# Altium schematic sheet thermocouple.SchDoc: Thermocouple Interface
size A4; SheetNumber: 6; SheetTotal: 7
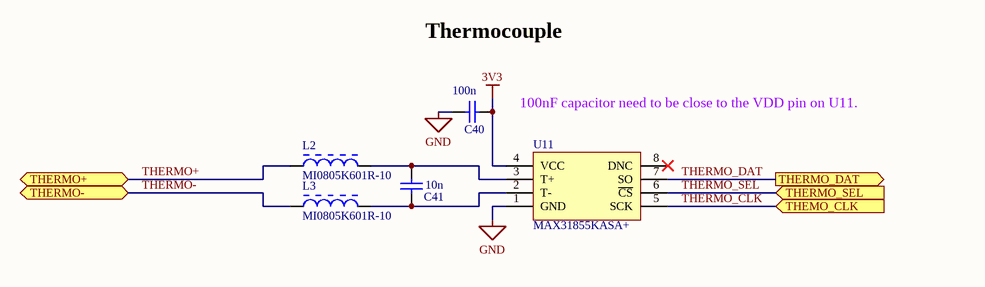
[diagram p0: thermocouple.SchDoc]

## Parts
C40  value 100n  [0805]  (hidden comment: Generic 0805 Capacitor)
C41  value 10n  [0805]  (hidden comment: Generic 0805 Capacitor)
L2  MI0805K601R-10  [0805]
L3  MI0805K601R-10  [0805]
U11  MAX31855KASA+  [SOIC8]

## Ports
THEMO_CLK (in), THERMO+ (bidir), THERMO- (bidir), THERMO_DAT (out), THERMO_SEL (in)

## Nets
3V3: C40.2 U11.4(VCC)
GND: C40.1 U11.1(GND)
THERMO+: L2.1 ; port THERMO+
THERMO-: L3.1 ; port THERMO-
THERMO_CLK: U11.5(SCK) ; port THEMO_CLK
THERMO_DAT: U11.7(SO) ; port THERMO_DAT
THERMO_SEL: U11.6(~{CS}) ; port THERMO_SEL
NetC41_1: C41.1 L3.2 U11.2(T-)
NetC41_2: C41.2 L2.2 U11.3(T+)

Not connected (* = marked no-connect by the designer): U11 8(DNC)*

## Notes on the sheet
- Thermocouple
- 100nF capacitor need to be close to the VDD pin on U11.
- Title
- Title:
- Project:
- Size:
- Date:
- File:
- E
- Number:
- Time:
- Revision:
- Sheet
- of

## Library data of the parts
C40 C41 = C_0805: Specifications: *
L2 L3 = MI0805K: Chip Bead for Power Filtering, 1500 mA, 600 Ohm, -40 to 125 degC, 0805 (2012 Metric), RoHS, Tape and Reel; Manufacturer: Laird; Filter Type: PowerLine; Current Rating (Max): 1.5A; Catalog Drawings: (HI,HZ,LI,MI)0805Series_1.10mmMax.Height; Impedance @ Frequency: 600Ohm@100MHz; Number of Lines: 1; DC Resistance (DCR) (Max): 100mOhm; Other Names: 240-2390-1; Kits: 240-2227-ND-KITEMIFERRITEBEADCHIPSMD; Online Catalog: MISeries; Standard Package: 1; Datasheet Version: Rev. A, 01/2004; Height (Max): 0.043"(1.10mm); Category: Filters; Operating Temperature: -40degC~125degC; Package Description: 2-Pin Surface Mount Device, Body 2 x 1.25 mm; Package / Case: 0805(2012Metric); Package Reference: MI0805K601R-10-2; Packaging: CutTape(CT); Ratings: -; Mounting Type: SurfaceMount; Datasheet URL: https://datasheet.ciiva.com/3082/mi0805k601r-10-a-vp-3082219.pdf; Size / Dimension: 0.079"Lx0.049"W(2.00mmx1.25mm); Family: FerriteBeadsandChips; Manufacturer URL: https://www.lairdtech.com; Series: MI
U11 = MAX31855: Cold-Junction Compensated / Thermocouple-to-Digital Converter; ComponentLink1Description: Manufacturer URL; ComponentLink3Description: Package Specification; ComponentLink2URL: http://cds.linear.com/docs/en/datasheet/4356fa.pdf; ComponentLink3URL: http://cds.linear.com/docs/en/packaging/05081661_F_MS.pdf; ComponentLink1URL: http://www.linear.com/; ComponentLink2Description: Datasheet